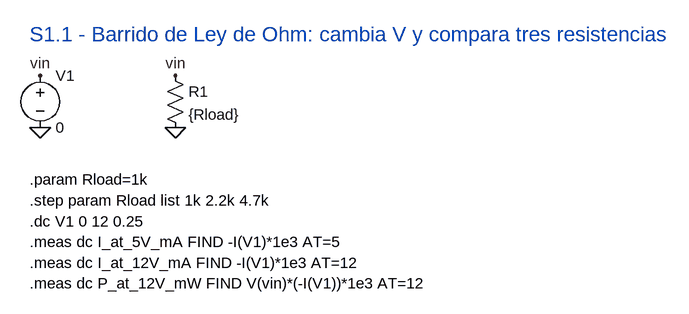
[diagram p0: schematic semana1_01_ohm_barrido.asc]
semana1_01_ohm_barrido.asc, the LTspice schematic file:
Version 4
SHEET 1 1112 680
FLAG 80 112 vin
FLAG 80 192 0
FLAG 288 112 vin
FLAG 288 192 0
SYMBOL voltage 80 96 R0
WINDOW 123 0 0 Left 0
WINDOW 39 0 0 Left 0
SYMATTR InstName V1
SYMATTR Value 0
SYMBOL res 272 96 R0
SYMATTR InstName R1
SYMATTR Value {Rload}
TEXT 64 272 Left 2 !.param Rload=1k
TEXT 64 304 Left 2 !.step param Rload list 1k 2.2k 4.7k
TEXT 64 336 Left 2 !.dc V1 0 12 0.25
TEXT 64 368 Left 2 !.meas dc I_at_5V_mA FIND -I(V1)*1e3 AT=5
TEXT 64 400 Left 2 !.meas dc I_at_12V_mA FIND -I(V1)*1e3 AT=12
TEXT 64 432 Left 2 !.meas dc P_at_12V_mW FIND V(vin)*(-I(V1))*1e3 AT=12
TEXT 64 48 Left 3 ;S1.1 - Barrido de Ley de Ohm: cambia V y compara tres resistencias

The netlist it stands for:
* semana1_01_ohm_barrido.asc
V1 vin 0 0
R1 vin 0 {Rload}
.param Rload=1k
.step param Rload list 1k 2.2k 4.7k
.dc V1 0 12 0.25
.meas dc I_at_5V_mA FIND -I(V1)*1e3 AT=5
.meas dc I_at_12V_mA FIND -I(V1)*1e3 AT=12
.meas dc P_at_12V_mW FIND V(vin)*(-I(V1))*1e3 AT=12
* S1.1 - Barrido de Ley de Ohm: cambia V y compara tres resistencias
.backanno
.end